# Altium schematic sheet Communication.SchDoc
size A
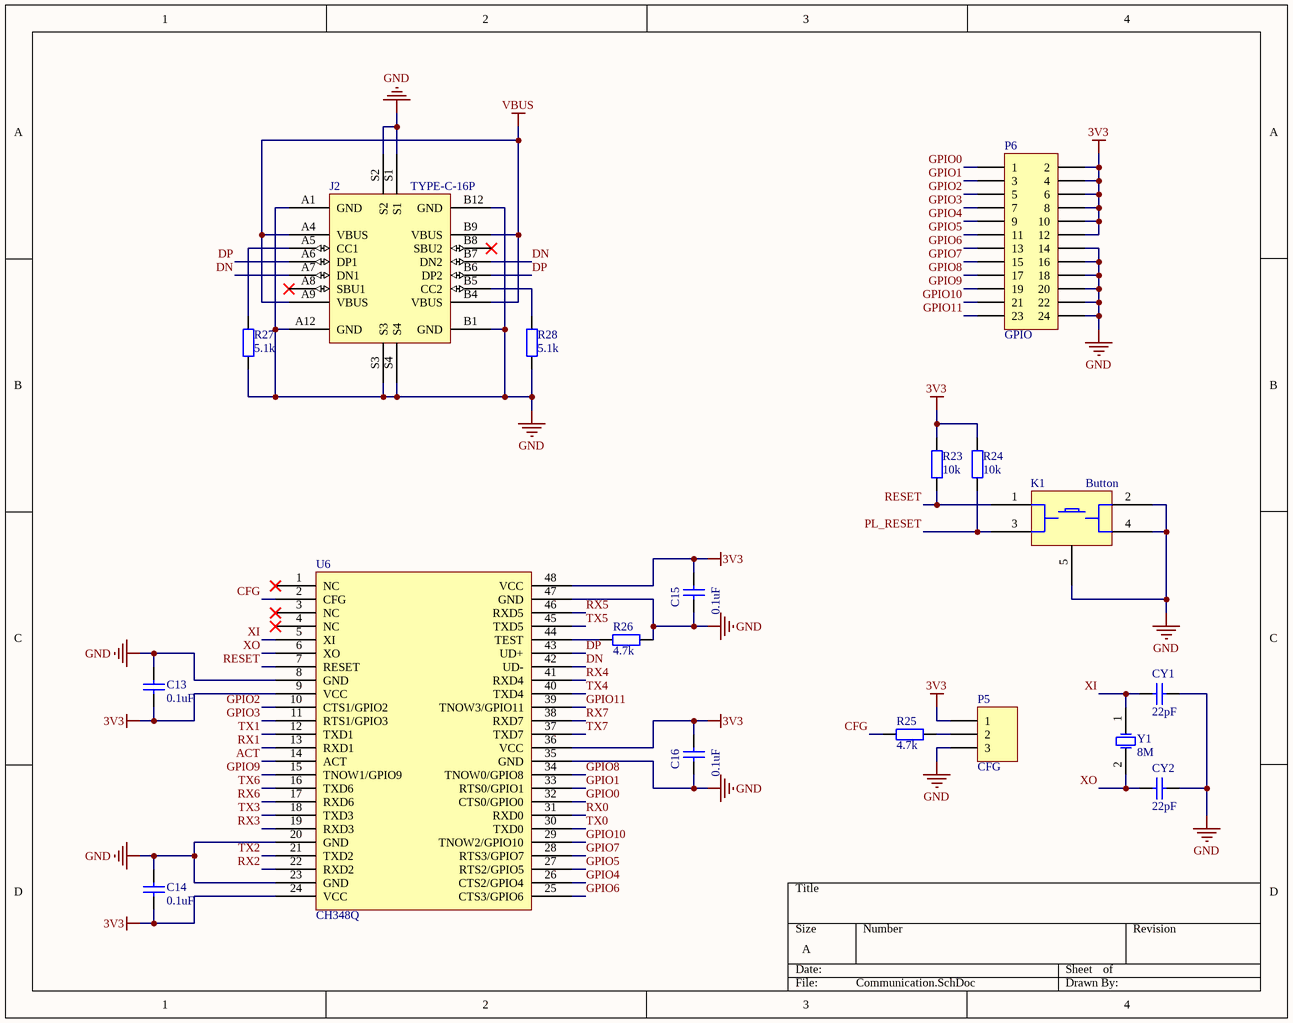
[diagram p0: Communication.SchDoc]

## Parts
C13  0.1uF  [CHIP-0603]
C14  0.1uF  [CHIP-0603]
C15  0.1uF  [CHIP-0603]
C16  0.1uF  [CHIP-0603]
CY1  22pF  [CHIP-0603]
CY2  22pF  [CHIP-0603]
J2  TYPE-C-16P  [CONN_KH-TYPE-C_SKE]
K1  Button  [Button]
P5  CFG  [HDR1X3]
P6  GPIO  [HDR2X12]
R23  10k  [CHIP-0603]
R24  10k  [CHIP-0603]
R25  4.7k  [CHIP-0603]
R26  4.7k  [CHIP-0603]
R27  5.1k  [CHIP-0603]
R28  5.1k  [CHIP-0603]
U6  CH348Q  [LQFP-48]
Y1  8M  [S3D12.288000B20F30T]

## Nets
3V3: C13.2 C14.2 C15.2 C16.2 P5.1 P6.2 P6.4 P6.6 P6.8 P6.10 P6.12 R23.1 R24.1 U6.9(VCC) U6.24(VCC) U6.36(VCC) U6.48(VCC)
GND: C13.1 C14.1 C15.1 C16.1 CY1.1 CY2.1 J2.A1(GND) J2.A12(GND) J2.B1(GND) J2.B12(GND) J2.S1 J2.S2 J2.S3 J2.S4 K1.2(B) K1.4(B) K1.5(Shell) P5.3 P6.14 P6.16 P6.18 P6.20 P6.22 P6.24 R26.2 R27.1 R28.2 U6.8(GND) U6.20(GND) U6.23(GND) U6.35(GND) U6.47(GND)
VBUS: J2.A4(VBUS) J2.A9(VBUS) J2.B4(VBUS) J2.B9(VBUS)
ACT: U6.14(ACT)
CFG: R25.1 U6.2(CFG)
DN: J2.A7(DN1) J2.B7(DN2) U6.42(UD-)
DP: J2.A6(DP1) J2.B6(DP2) U6.43(UD+)
GPIO0: P6.1 U6.32(CTS0/GPIO0)
GPIO1: P6.3 U6.33(RTS0/GPIO1)
GPIO2: P6.5 U6.10(CTS1/GPIO2)
GPIO3: P6.7 U6.11(RTS1/GPIO3)
GPIO4: P6.9 U6.26(CTS2/GPIO4)
GPIO5: P6.11 U6.27(RTS2/GPIO5)
GPIO6: P6.13 U6.25(CTS3/GPIO6)
GPIO7: P6.15 U6.28(RTS3/GPIO7)
GPIO8: P6.17 U6.34(TNOW0/GPIO8)
GPIO9: P6.19 U6.15(TNOW1/GPIO9)
GPIO10: P6.21 U6.29(TNOW2/GPIO10)
GPIO11: P6.23 U6.39(TNOW3/GPIO11)
PL_RESET: K1.3(A) R24.2
RESET: K1.1(A) R23.2 U6.7(RESET)
RX0: U6.31(RXD0)
RX1: U6.13(RXD1)
RX2: U6.22(RXD2)
RX3: U6.19(RXD3)
RX4: U6.41(RXD4)
RX5: U6.46(RXD5)
RX6: U6.17(RXD6)
RX7: U6.38(RXD7)
TX0: U6.30(TXD0)
TX1: U6.12(TXD1)
TX2: U6.21(TXD2)
TX3: U6.18(TXD3)
TX4: U6.40(TXD4)
TX5: U6.45(TXD5)
TX6: U6.16(TXD6)
TX7: U6.37(TXD7)
XI: CY1.2 U6.5(XI) Y1.1(OSC1)
XO: CY2.2 U6.6(XO) Y1.2(OSC2)
NetJ2_A5: J2.A5(CC1) R27.2
NetJ2_B5: J2.B5(CC2) R28.1
NetP5_2: P5.2 R25.2
NetR26_1: R26.1 U6.44(TEST)

Not connected (* = marked no-connect by the designer): J2 A8(SBU1)* B8(SBU2)*; U6 1(NC)* 3(NC)* 4(NC)*

## Library data of the parts
C13-C16 CY1 CY2 = Cap: Capacitor; Published: 8-Jun-2000; LatestRevisionDate: 17-Jul-2002; LatestRevisionNote: Re-released for DXP Platform.; PackageReference: RAD-0.3; Publisher: Altium Limited; PackageDescription: Radial Cap, Thru-Hole; 2 Leads; 0.3 in Pin Spacing
J2 = KH-TYPE-C-16P: No Description Available; Mfr_Name: Shenzhen Kinghelm Elec; RefDes: RefDes; Type: Type
P5 = Header 3: Header, 3-Pin; LatestRevisionDate: 17-Jul-2002; LatestRevisionNote: Re-released for DXP Platform.; Publisher: Altium Limited
P6 = Header 12X2: Header, 12-Pin, Dual row; LatestRevisionDate: 17-Jul-2002; LatestRevisionNote: Re-released for DXP Platform.; Publisher: Altium Limited
R23-R28 = Res2: Resistor; Published: 8-Jun-2000; LatestRevisionDate: 17-Jul-2002; LatestRevisionNote: Re-released for DXP Platform.; PackageReference: AXIAL-0.4; Publisher: Altium Limited; PackageDescription: Axial Device, Thru-Hole; 2 Leads; 0.4 in Pin Spacing
Y1 = XTAL: Crystal Oscillator; Published: 8-Jun-2000; LatestRevisionDate: 17-Jul-2002; LatestRevisionNote: Re-released for DXP Platform.; PackageReference: R38; Publisher: Altium Limited; PackageDescription: Crystal, Thru-Hole; 2 Leads; Body 3.1 x 8.2 mm (Dia.xH)